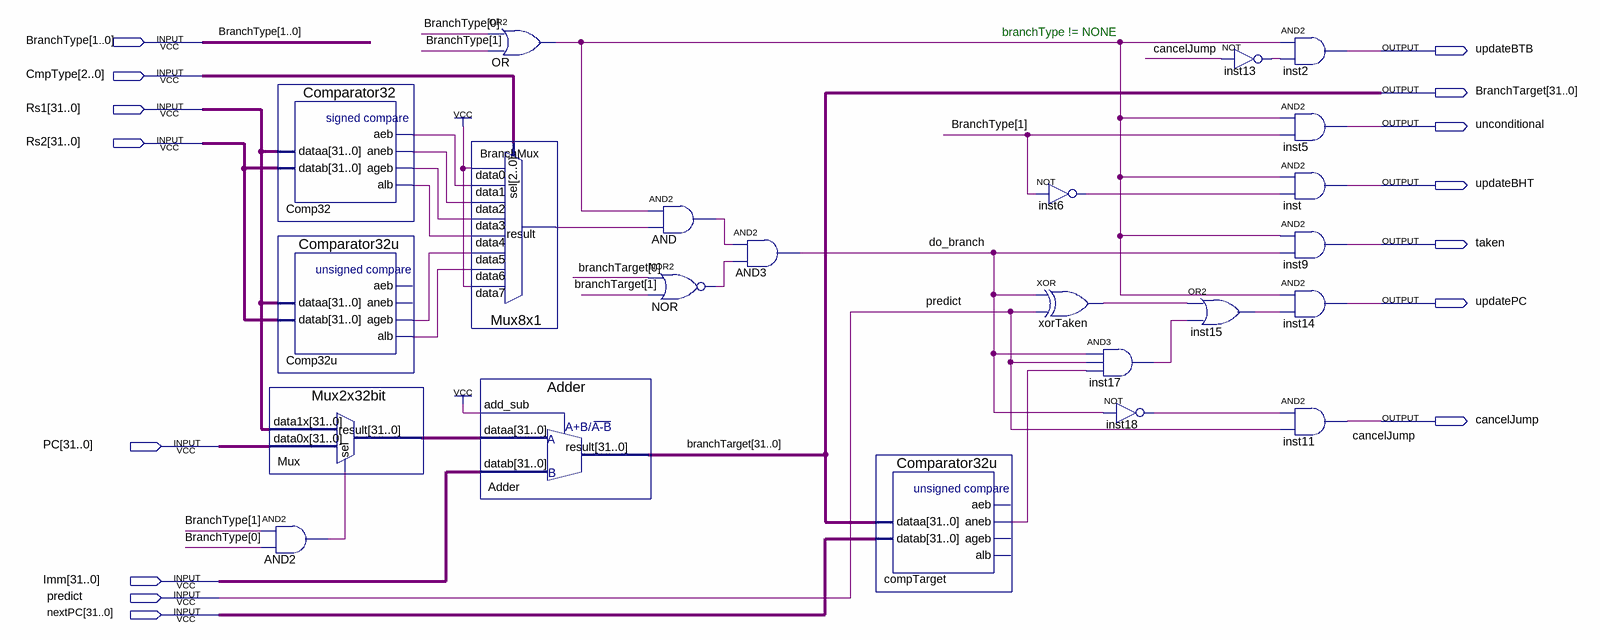
[diagram p0: schematic sheet]
// Quartus schematic ExecuteBranch.bdf as structural Verilog: 23 symbols, 15 pins
module ExecuteBranch (
  input  [1:0] BranchType,
  input  [2:0] CmpType,
  input  [31:0] Rs1,
  input  [31:0] Rs2,
  input  [31:0] PC,
  input  [31:0] Imm,
  input  predict,
  input  [31:0] nextPC,
  output updateBTB,
  output [31:0] BranchTarget,
  output unconditional,
  output updateBHT,
  output taken,
  output updatePC,
  output cancelJump
);

  wire AND2_out, AND_out, BranchMux_result, Comp32_aeb, Comp32_ageb, Comp32_alb, Comp32_aneb, Comp32u_ageb,
       Comp32u_alb, compTarget_aneb, do_branch, inst6_out, inst13_out, inst15_out, inst17_out, inst18_out,
       NOR_out, OR_out, xorTaken_out;
  wire [31:0] Mux_result;

  Comparator32 Comp32 (
    .dataa(Rs1), .datab(Rs2), .aeb(Comp32_aeb), .aneb(Comp32_aneb), .ageb(Comp32_ageb), .alb(Comp32_alb));
  Comparator32u Comp32u (.dataa(Rs1), .datab(Rs2), .ageb(Comp32u_ageb), .alb(Comp32u_alb));  // open: aeb, aneb
  Mux2x32bit Mux (.data1x(Rs1), .data0x(PC), .sel(AND2_out), .result(Mux_result));
  and AND2 (AND2_out, BranchType[1], BranchType[0]);
  Mux8x1 BranchMux (
    .data7(1'b1), .data6(Comp32u_alb), .data5(Comp32u_ageb), .data4(Comp32_alb), .data3(Comp32_ageb),
    .data2(Comp32_aneb), .data1(Comp32_aeb), .data0(1'b1), .sel(CmpType), .result(BranchMux_result));
  Adder Adder (.add_sub(1'b1), .dataa(Mux_result), .datab(Imm), .result(BranchTarget));
  or OR (OR_out, BranchType[0], BranchType[1]);
  and AND (AND_out, OR_out, BranchMux_result);
  nor NOR (NOR_out, BranchTarget[0], BranchTarget[1]);
  and AND3 (do_branch, AND_out, NOR_out);
  Comparator32u compTarget (.dataa(BranchTarget), .datab(nextPC), .aneb(compTarget_aneb));  // open: aeb, ageb, alb
  not inst6 (inst6_out, BranchType[1]);
  xor xorTaken (xorTaken_out, do_branch, predict);
  and inst17 (inst17_out, do_branch, predict, compTarget_aneb);
  not inst18 (inst18_out, do_branch);
  not inst13 (inst13_out, cancelJump);
  or inst15 (inst15_out, xorTaken_out, inst17_out);
  and inst2 (updateBTB, OR_out, inst13_out);
  and inst5 (unconditional, OR_out, BranchType[1]);
  and inst (updateBHT, OR_out, inst6_out);
  and inst9 (taken, OR_out, do_branch);
  and inst14 (updatePC, OR_out, inst15_out);
  and inst11 (cancelJump, inst18_out, predict);

  // Notes on the sheet:
  //   branchType != NONE
endmodule
